# EAGLE schematic esquema_synesthesia (EAGLE 8.1.0)
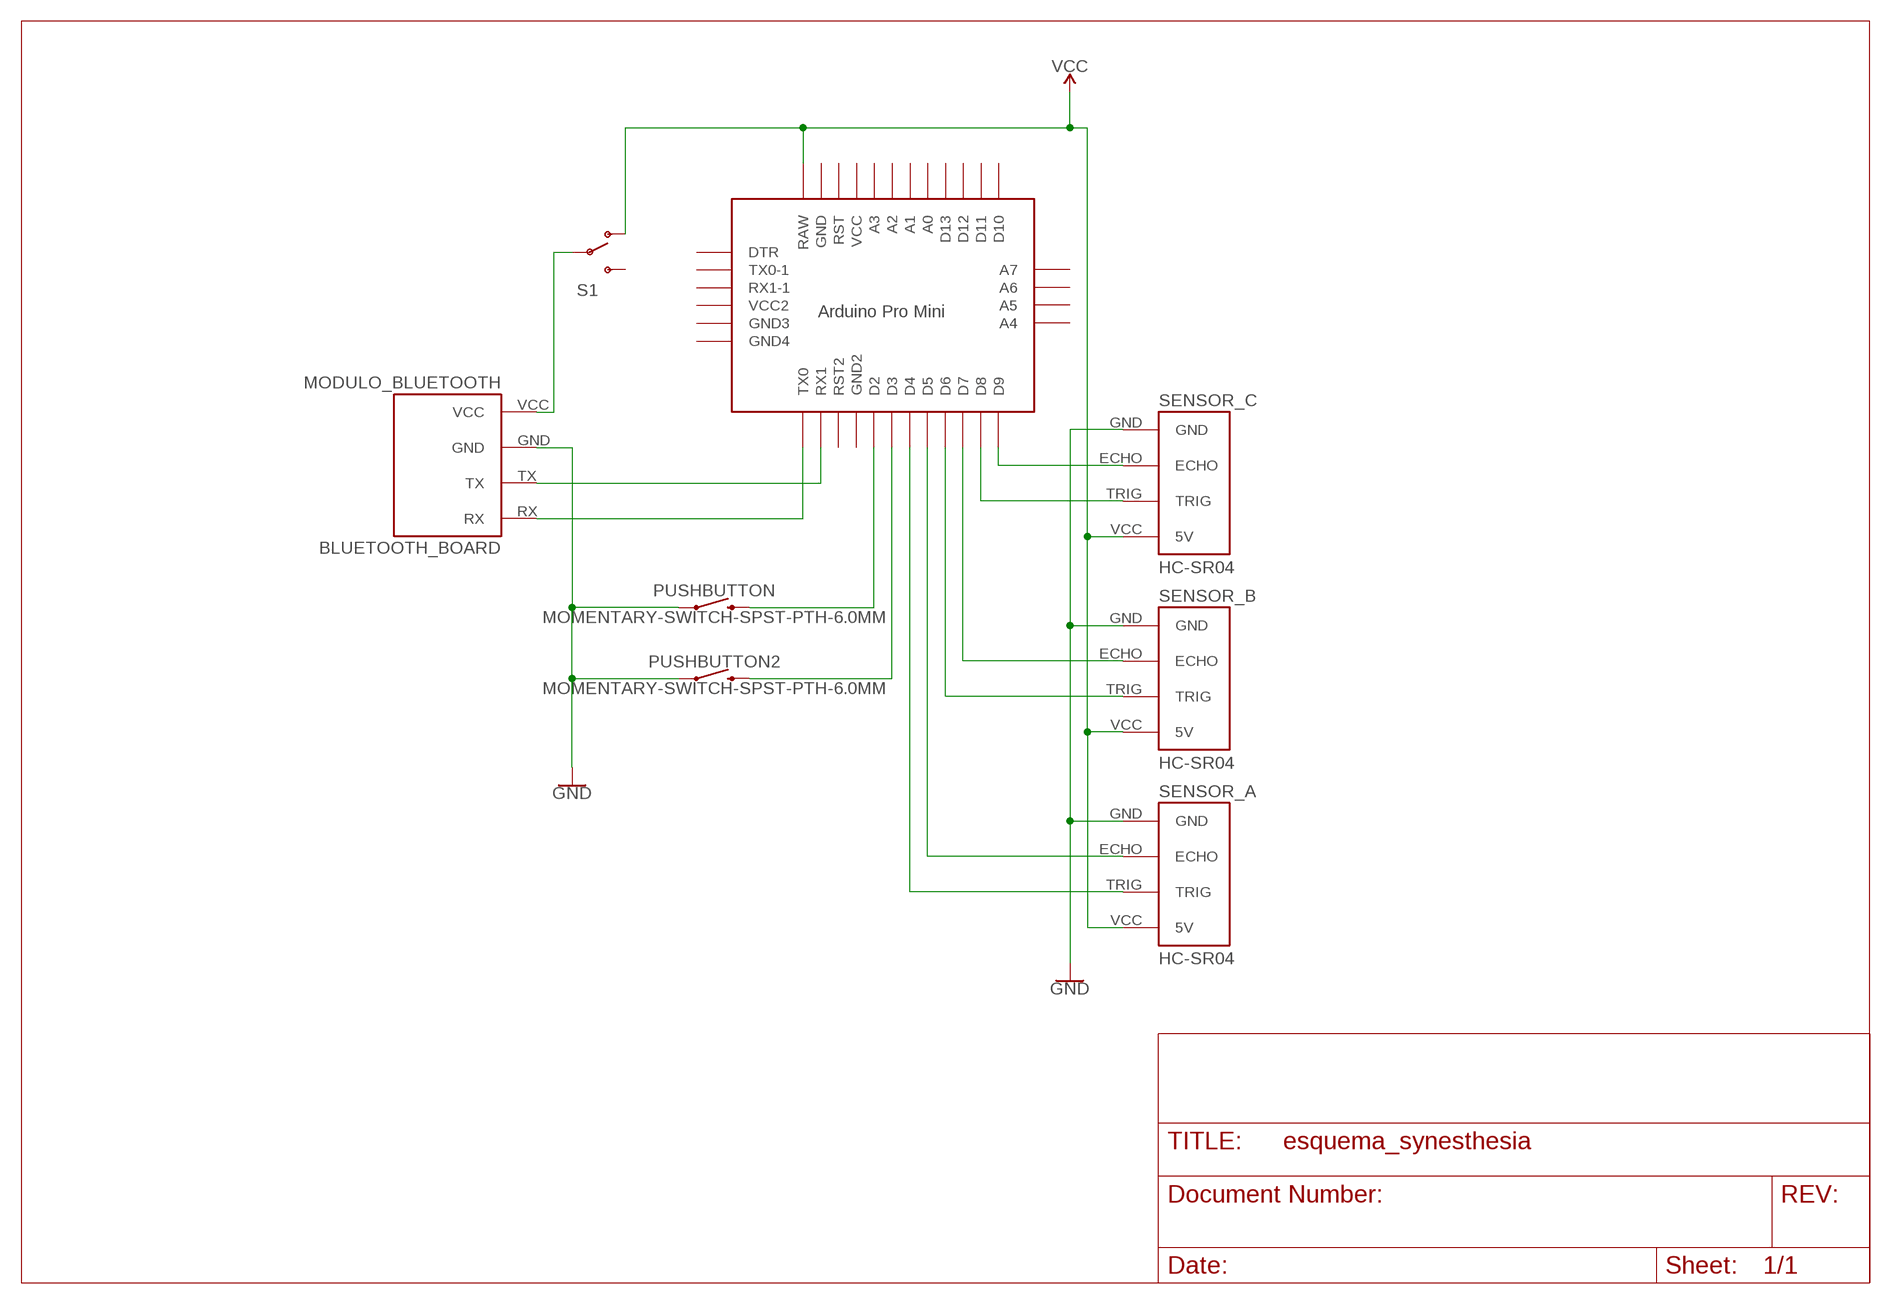
[diagram p0: schematic, sheet 1]

## Parts
MODULO_BLUETOOTH  BLUETOOTH_BOARD  [BT_BOARD_FOOTPRINT]
PUSHBUTTON  MOMENTARY-SWITCH-SPST-PTH-6.0MM  [TACTILE_SWITCH_PTH_6.0MM]
PUSHBUTTON2  MOMENTARY-SWITCH-SPST-PTH-6.0MM  [TACTILE_SWITCH_PTH_6.0MM]
S1  SWITCH-SPDTPTH2  [SWITCH-DPDT]
SENSOR_A  HC-SR04  [HC-SR04_FOOTPRINT]
SENSOR_B  HC-SR04  [HC-SR04_FOOTPRINT]
SENSOR_C  HC-SR04  [HC-SR04_FOOTPRINT]
U$1  PRO-MINI  [PRO-MINI]

## Nets
GND: MODULO_BLUETOOTH.GND PUSHBUTTON2.1 PUSHBUTTON.1 SENSOR_A.GND SENSOR_B.GND SENSOR_C.GND
N$1: MODULO_BLUETOOTH.RX U$1.TX0
N$2: MODULO_BLUETOOTH.TX U$1.RX1
N$3: PUSHBUTTON.3 U$1.D2
N$4: PUSHBUTTON2.3 U$1.D3
N$5: MODULO_BLUETOOTH.VCC S1.2(P)
N$7: SENSOR_A.TRIG U$1.D4
N$8: SENSOR_A.ECHO U$1.D5
N$9: SENSOR_B.TRIG U$1.D6
N$10: SENSOR_B.ECHO U$1.D7
N$11: SENSOR_C.TRIG U$1.D8
N$12: SENSOR_C.ECHO U$1.D9
VCC: S1.1(O) SENSOR_A.VCC(5V) SENSOR_B.VCC(5V) SENSOR_C.VCC(5V) U$1.RAW
Unconnected: S1.3(S) U$1.A0 U$1.A1 U$1.A2 U$1.A3 U$1.A4 U$1.A5 U$1.A6 U$1.A7 U$1.D10 U$1.D11 U$1.D12 U$1.D13 U$1.DTR U$1.GND U$1.GND1(GND2) U$1.GND2(GND4) U$1.GND3 U$1.RST U$1.RST1(RST2) U$1.RX1-1 U$1.TX0-1 U$1.VCC U$1.VCC1(VCC2)

## Library data of the parts
MODULO_BLUETOOTH = Bluetooth HC-05:BLUETOOTH_BOARD: Bluetooth Board V1.05
PUSHBUTTON PUSHBUTTON2 = SparkFun-Switches:MOMENTARY-SWITCH-SPST: Momentary Switch (Pushbutton) - SPST Normally-open (NO) SPST momentary switches (buttons, pushbuttons). Variants PTH-12MM - 12mm square, through-hole Momentary Pushbutton Switch - 12mm Square <https://www.sparkfun.com/products/9190> (COM-09190) PTH-6.0MM, PTH-6.0MM-KIT - 6.0mm square, through-hole Mini Pushbutton Switch <https://www.sparkfun.com/products/97> (COM-00097) KIT package intended for soldering kit's - only one side of pads' copper is exposed. PTH-RIGHT-ANGLE-KIT - Right-angle, through-hole Right Angle Tactile Button <https://www.sparkfun.com/products/10791> - Used on SparkFun BigTime Watch Kit <https://www.sparkfun.com/products/11734> SMD-12MM - 12mm square, surface-mount Tactile Button - SMD (12mm) <https://www.sparkfun.com/products/12993> (COM-12993) Used on SparkFun PicoBoard <https://www.sparkfun.com/products/11888> SMD-4.5MM - 4.5mm Square Trackball Switch Used on SparkFun Blackberry Trackballer Breakout <https://www.sparkfun.com/products/13169> SMD-4.6MMX2.8MM - 4.60mm x 2.80mm, surface mount Used on SparkFun SAMD21 Mini Breakout <https://www.sparkfun.com/products/13664> SMD-5.2MM, SMD-5.2-REDUNDANT - 5.2mm square, surface-mount Mini Pushbutton Switch - SMD <https://www.sparkfun.com/products/8720> (COM-08720) Used on Arduino Pro Mini <https://www.sparkfun.com/products/11114> REDUNDANT package connects both switch circuits together SMD-6.0X3.5MM - 6.0 x 3.5mm, surface mount Momentary Reset Switch SMD <https://www.sparkfun.com/products/8229> (COM-08229) SMD-6.2MM-TALL - 6.2mm square, surface mount Tactile Button - SMD (6mm) <https://www.sparkfun.com/products/12992> Used on SparkFun Digital Sandbox <https://www.sparkfun.com/products/12651> SMD-RIGHT-ANGLE - Right-angle, surface mount Used on SparkFun Block for Intel® Edison - Arduino <https://www.sparkfun.com/products/13036>; PROD_ID: SWCH-08441; SF_SKU: COM-00097
S1 = SparkFun-Retired:SWITCH-SPDT: SPDT Switch Simple slide switch, Spark Fun Electronics SKU : COM-00102 DPDT SMT slide switch, AYZ0202, SWCH-08179
SENSOR_A SENSOR_B SENSOR_C = Ultrasonic Sensor HC-SR04:HC-SR04: Ultrasonic Sensor HC-SR04
U$1 = Arduino-clone:PRO-MINI: Arduion Pro Mini Clone V1.0 www.betemcu.cu